# Altium project steering-wheel.PrjPcb
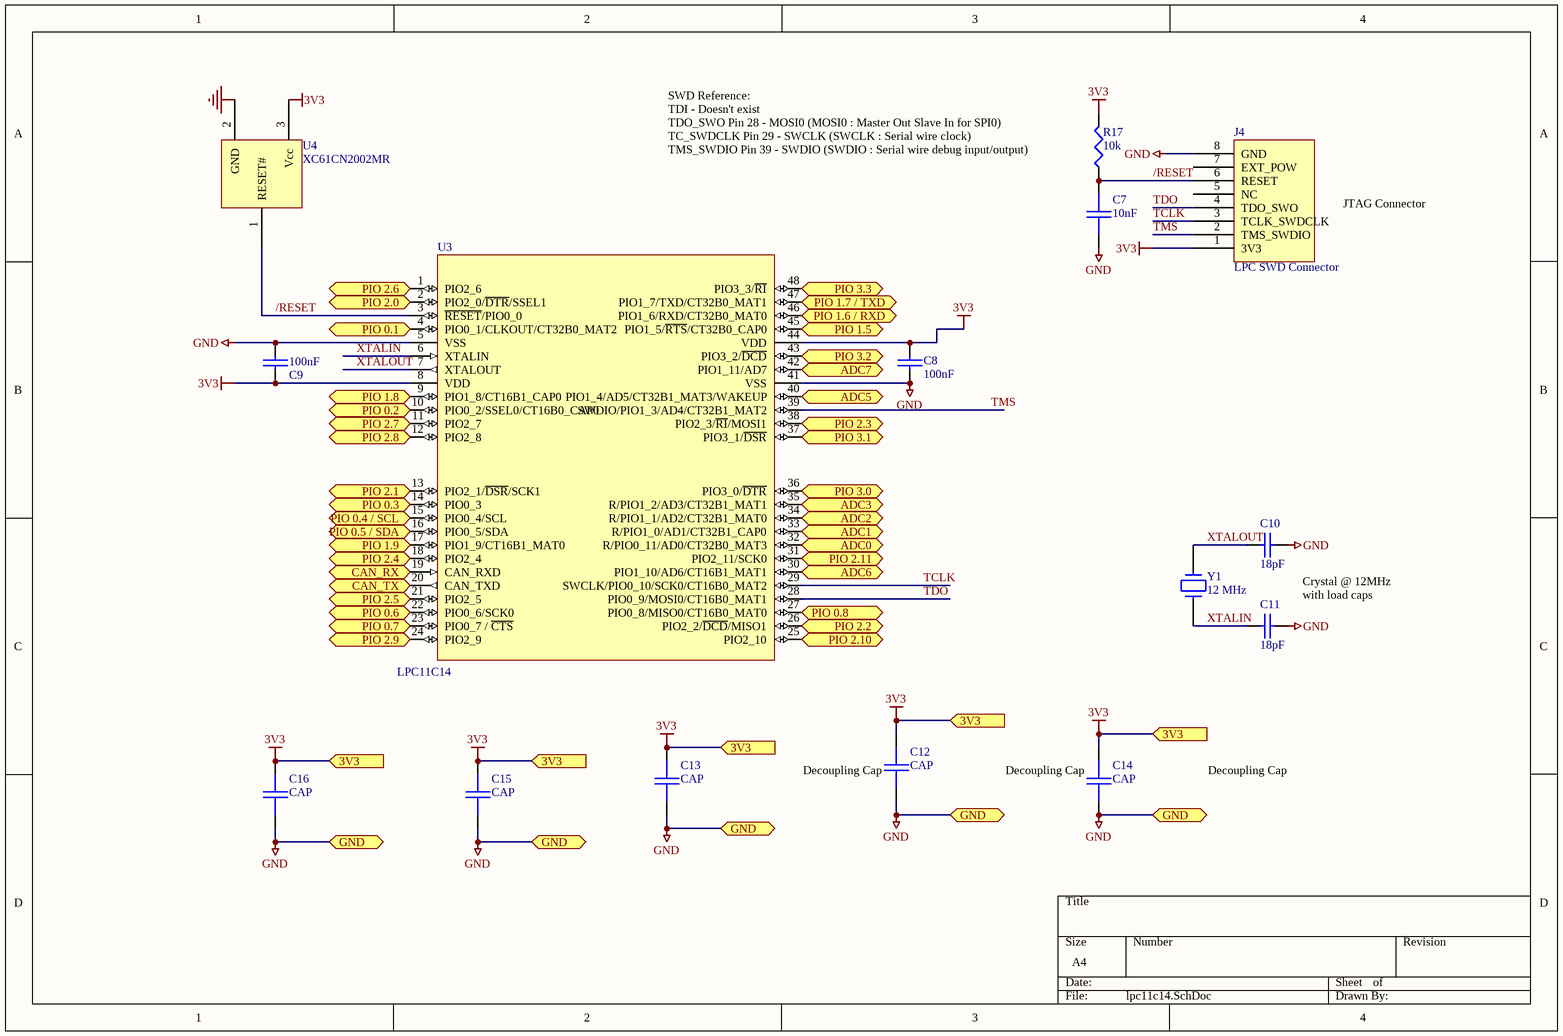
[diagram p0: lpc11c14.SchDoc]
3 sheets, 30 parts. Net scope: flat (ports and power ports of the same name join across sheets).
Board files: CAN_faceplate.PcbDoc, project_name.PcbDoc, project_name_faceplate.PcbDoc
Sheets:
  lpc11c14.SchDoc
  power_supply.SchDoc
  can_unisolated.SchDoc

## Sheet lpc11c14.SchDoc
size A4

### Parts
C7  10nF  [0603]
C8  100nF  [0603]
C9  100nF  [0603]
C10  18pF  [0603]
C11  18pF  [0603]
C12  CAP  [0603]
C13  CAP  [0603]
C14  CAP  [0603]
C15  CAP  [0603]
C16  CAP  [0603]
J4  LPC SWD Connector  [HDR1X8]
R17  10k  [0603]
U3  LPC11C14  [QFP48-long]
U4  XC61CN2002MR  [SOT23-3]
Y1  12 MHz  [HC49/4H]

### Ports
3V3, ADC0, ADC1, ADC2, ADC3, ADC5, ADC6, ADC7, CAN_RX (bidir), CAN_TX, GND, PIO 0.1 (bidir), PIO 0.2 (bidir), PIO 0.3, PIO 0.4 / SCL (bidir), PIO 0.5 / SDA (bidir), PIO 0.6, PIO 0.7, PIO 0.8, PIO 1.5, PIO 1.6 / RXD (bidir), PIO 1.7 / TXD (bidir), PIO 1.8, PIO 1.9, PIO 2.0 (bidir), PIO 2.1 (bidir), PIO 2.2, PIO 2.3, PIO 2.4, PIO 2.5, PIO 2.6 (bidir), PIO 2.7 (bidir), PIO 2.8 (bidir), PIO 2.9, PIO 2.10, PIO 2.11, PIO 3.0, PIO 3.1, PIO 3.2, PIO 3.3

### Nets
3V3: C8.1 C9.2 C12.1 C13.1 C14.1 C15.1 C16.1 J4.1(3V3) R17.2 U3.8(VDD) U3.44(VDD) U4.3(Vcc) ; port 3V3
GND: C7.2 C8.2 C9.1 C10.2 C11.2 C12.2 C13.2 C14.2 C15.2 C16.2 J4.8(GND) U3.5(VSS) U3.41(VSS) U4.2(GND) ; port GND
/RESET: C7.1 J4.6(RESET) R17.1 U3.3(~{RESET}/PIO0_0) U4.1(RESET#)
TCLK: J4.3(TCLK_SWDCLK) U3.29(SWCLK/PIO0_10/SCK0/CT16B0_MAT2)
TDO: J4.4(TDO_SWO) U3.28(PIO0_9/MOSI0/CT16B0_MAT1)
TMS: J4.2(TMS_SWDIO) U3.39(SWDIO/PIO1_3/AD4/CT32B1_MAT2)
XTALIN: C11.1 U3.6(XTALIN) Y1.1
XTALOUT: C10.1 U3.7(XTALOUT) Y1.2
NetU2_1: U3.20(CAN_TXD) ; port CAN_TX
NetU2_4: U3.19(CAN_RXD) ; port CAN_RX
NetU3_1: U3.1(PIO2_6) ; port PIO 2.6
NetU3_2: U3.2(PIO2_0/~{DTR}/SSEL1) ; port PIO 2.0
NetU3_4: U3.4(PIO0_1/CLKOUT/CT32B0_MAT2) ; port PIO 0.1
NetU3_9: U3.9(PIO1_8/CT16B1_CAP0) ; port PIO 1.8
NetU3_10: U3.10(PIO0_2/SSEL0/CT16B0_CAP0) ; port PIO 0.2
NetU3_11: U3.11(PIO2_7) ; port PIO 2.7
NetU3_12: U3.12(PIO2_8) ; port PIO 2.8
NetU3_13: U3.13(PIO2_1/~{DSR}/SCK1) ; port PIO 2.1
NetU3_14: U3.14(PIO0_3) ; port PIO 0.3
NetU3_15: U3.15(PIO0_4/SCL) ; port PIO 0.4 / SCL
NetU3_16: U3.16(PIO0_5/SDA) ; port PIO 0.5 / SDA
NetU3_17: U3.17(PIO1_9/CT16B1_MAT0) ; port PIO 1.9
NetU3_18: U3.18(PIO2_4) ; port PIO 2.4
NetU3_21: U3.21(PIO2_5) ; port PIO 2.5
NetU3_22: U3.22(PIO0_6/SCK0) ; port PIO 0.6
NetU3_23: U3.23(PIO0_7_/_~{CTS}) ; port PIO 0.7
NetU3_24: U3.24(PIO2_9) ; port PIO 2.9
NetU3_25: U3.25(PIO2_10) ; port PIO 2.10
NetU3_26: U3.26(PIO2_2/~{DCD}/MISO1) ; port PIO 2.2
NetU3_27: U3.27(PIO0_8/MISO0/CT16B0_MAT0) ; port PIO 0.8
NetU3_30: U3.30(PIO1_10/AD6/CT16B1_MAT1) ; port ADC6
NetU3_31: U3.31(PIO2_11/SCK0) ; port PIO 2.11
NetU3_32: U3.32(R/PIO0_11/AD0/CT32B0_MAT3) ; port ADC0
NetU3_33: U3.33(R/PIO1_0/AD1/CT32B1_CAP0) ; port ADC1
NetU3_34: U3.34(R/PIO1_1/AD2/CT32B1_MAT0) ; port ADC2
NetU3_35: U3.35(R/PIO1_2/AD3/CT32B1_MAT1) ; port ADC3
NetU3_36: U3.36(PIO3_0/~{DTR}) ; port PIO 3.0
NetU3_37: U3.37(PIO3_1/~{DSR}) ; port PIO 3.1
NetU3_38: U3.38(PIO2_3/~{RI}/MOSI1) ; port PIO 2.3
NetU3_40: U3.40(PIO1_4/AD5/CT32B1_MAT3/WAKEUP) ; port ADC5
NetU3_42: U3.42(PIO1_11/AD7) ; port ADC7
NetU3_43: U3.43(PIO3_2/~{DCD}) ; port PIO 3.2
NetU3_45: U3.45(PIO1_5/~{RTS}/CT32B0_CAP0) ; port PIO 1.5
NetU3_46: U3.46(PIO1_6/RXD/CT32B0_MAT0) ; port PIO 1.6 / RXD
NetU3_47: U3.47(PIO1_7/TXD/CT32B0_MAT1) ; port PIO 1.7 / TXD
NetU3_48: U3.48(PIO3_3/~{RI}) ; port PIO 3.3

Not connected (* = marked no-connect by the designer): J4 5(NC) 7(EXT_POW)

### Notes on the sheet
- SWD Reference:
  TDI - Doesn't exist
  TDO_SWO Pin 28 - MOSI0 (MOSI0 : Master Out Slave In for SPI0)
  TC_SWDCLK Pin 29 - SWCLK (SWCLK : Serial wire clock)
  TMS_SWDIO Pin 39 - SWDIO (SWDIO : Serial wire debug input/output)
- JTAG Connector
- Crystal @ 12MHz with load caps
- (near C12) Decoupling Cap
- (near C14) Decoupling Cap
- Decoupling Cap

### Library data of the parts
C7-C9 = CAP: Capacitor; Needed?: NO - HW LAB
  C7: Value: 10nF
  C8 C9: Value: 100nF
C10 C11 = CAP: Capacitor; Needed?: Farnell; Value: 18pF; Farnell: 1844169; Farnell Price: 0.025
C12-C16 = CAP: Capacitor
J4 = LPCLink_Connector: Needed?: NO - Common; Farnell: 9733566
R17 = RES1: Resistor; Needed?: NO - HW LAB; Value: 10k
U3 = LPC11C14_Full: Needed?: Farnell; Farnell: 1812185; Farnell Price: 8.38
U4 = XC61F: SOT23 reset generator; Needed?: Farnell; Farnell: 3605486; Farnell Price: 1.74
Y1 = CRYSTAL: Element14: 1640897

## Sheet power_supply.SchDoc
size A4
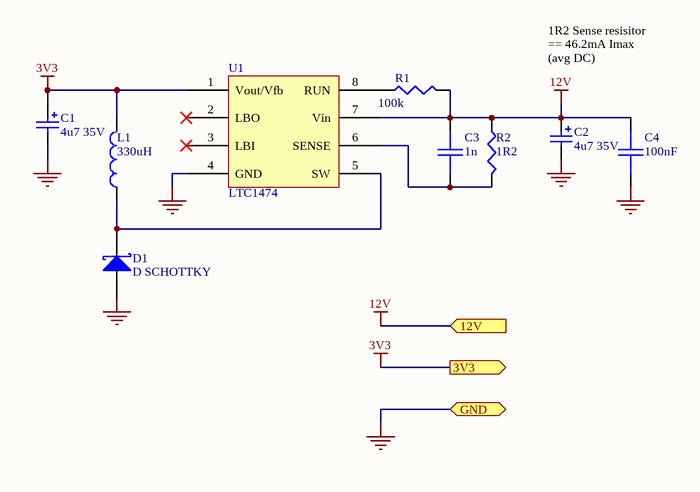
[diagram p1: power_supply.SchDoc]

### Parts
C1  4u7 35V  [MCCT-CASEC]
C2  4u7 35V  [MCCT-CASEC]
C3  1n  [0603]
C4  100nF  [0603]
D1  D SCHOTTKY  [SMB]
L1  330uH  [1812]
R1  100k  [0603]
R2  1R2  [0603]
U1  LTC1474  [SO8]

### Ports
3V3, 12V, GND

### Nets
3V3: C1.1 L1.2 U1.1(Vout/Vfb) ; port 3V3
12V: C2.1 C3.1 C4.1 R1.2 R2.1 U1.7(Vin) ; port 12V
GND: C1.2 C2.2 C4.2 D1.A U1.4(GND) ; port GND
NetC3_2: C3.2 R2.2 U1.6(SENSE)
NetD1_K: D1.K L1.1 U1.5(SW)
NetR1_1: R1.1 U1.8(RUN)

Not connected (* = marked no-connect by the designer): U1 2(LBO)* 3(LBI)*

### Notes on the sheet
- 1R2 Sense resisitor == 46.2mA Imax (avg DC)

### Library data of the parts
C1 C2 = Cap Pol3: Polarized Capacitor (Surface Mount); Value: 4.7uF; Order#: 197609; Revision: July-2002: Re-released for DXP Platform.; Price: 1.41; Supplier: Farnell
C3 = CAP: Capacitor; Value: 1nF; Order#: 317-202; Revision: July-2002: Re-released for DXP Platform.; Price: 0.12; Supplier: Farnell
C4 = CAP: Capacitor; Value: 0.1uF; Order#: 753-567; Revision: July-2002: Re-released for DXP Platform.; Price: 0.13; Supplier: Farnell
D1 = D SCHOTTKY: Schottky Diode; Manufacturer: Generic Components; Class I: Discrete; Class II: Diode - Schottky; Published: 8-Jun-2000; Revision: July-2002: Re-released for DXP Platform.; Publisher: Altium Limited
L1 = Inductor: Order#: 8808538; Revision: July-2002: Re-released for DXP Platform.; Value: 330uH; Price: 1.96; Supplier: Farnell
R1 = RES1: Resistor; Order#: 9331719; Value: 100k; Price: 0.05; Supplier: Farnell
R2 = RES1: Resistor; Value: 1.2R; Order#: 139-9658; Revision: July-2002: Re-released for DXP Platform.; Price: 0.515; Supplier: Farnell
U1 = LTC1474: Step-down converter; Order#: LTC1474CMS8-3.3-ND; Supplier: Digikey; Price: 7.42

## Sheet can_unisolated.SchDoc
size A4
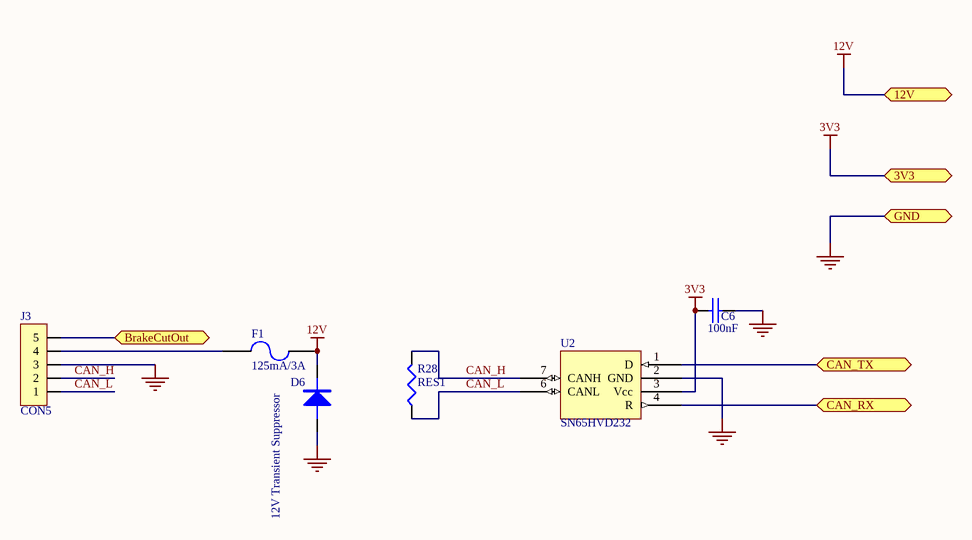
[diagram p2: can_unisolated.SchDoc]

### Parts
C6  100nF  [0603]
D6  12V Transient Suppressor  [SMA]
F1  125mA/3A  [LITTELFUSE-154]
J3  CON5  [ENG.1B.305.CLL]
R28  RES1  [0603]
U2  SN65HVD232  [SO8]

### Ports
3V3, 12V, BrakeCutOut, CAN_RX, CAN_TX, GND

### Nets
3V3: C6.2 U2.3(Vcc) ; port 3V3
12V: D6.K F1.2 ; port 12V
GND: C6.1 D6.A J3.3 U2.2(GND) ; port GND
CAN_H: J3.2 R28.2 U2.7(CANH)
CAN_L: J3.1 R28.1 U2.6(CANL)
NetF1_1: F1.1 J3.4
NetJ3_5: J3.5 ; port BrakeCutOut
NetU2_1: U2.1(D) ; port CAN_TX
NetU2_4: U2.4(R) ; port CAN_RX

### Library data of the parts
C6 = CAP: Capacitor; Order#: 753-567; Price: 0.31; Supplier: Farnell
D6 = DIODE: Order#: 980-2754; Price: 1.25; Supplier: Farnell
F1 = FUSE2: Fuse; Order#: 994-3609; Other Info: www.littelfuse.com; Price: 7.78; Supplier: Farnell
J3 = CON5: Connector; RS: 173-2578
R28 = RES1: Resistor
U2 = SN65HVD232: 3.3V CAN Transciever; Order#: 296-12282-5-ND; Supplier: Digikey; Price: 2.93

## Nets that join several sheets
3V3: lpc11c14 (12 pins), power_supply (C1.1 L1.2 U1.1), can_unisolated (C6.2 U2.3)
12V: power_supply (6 pins), can_unisolated (D6.K F1.2)
GND: lpc11c14 (14 pins), power_supply (5 pins), can_unisolated (C6.1 D6.A J3.3 U2.2)
NetU2_1: lpc11c14 (U3.20), can_unisolated (U2.1)
NetU2_4: lpc11c14 (U3.19), can_unisolated (U2.4)